# Altium project TE0888.PrjPCB
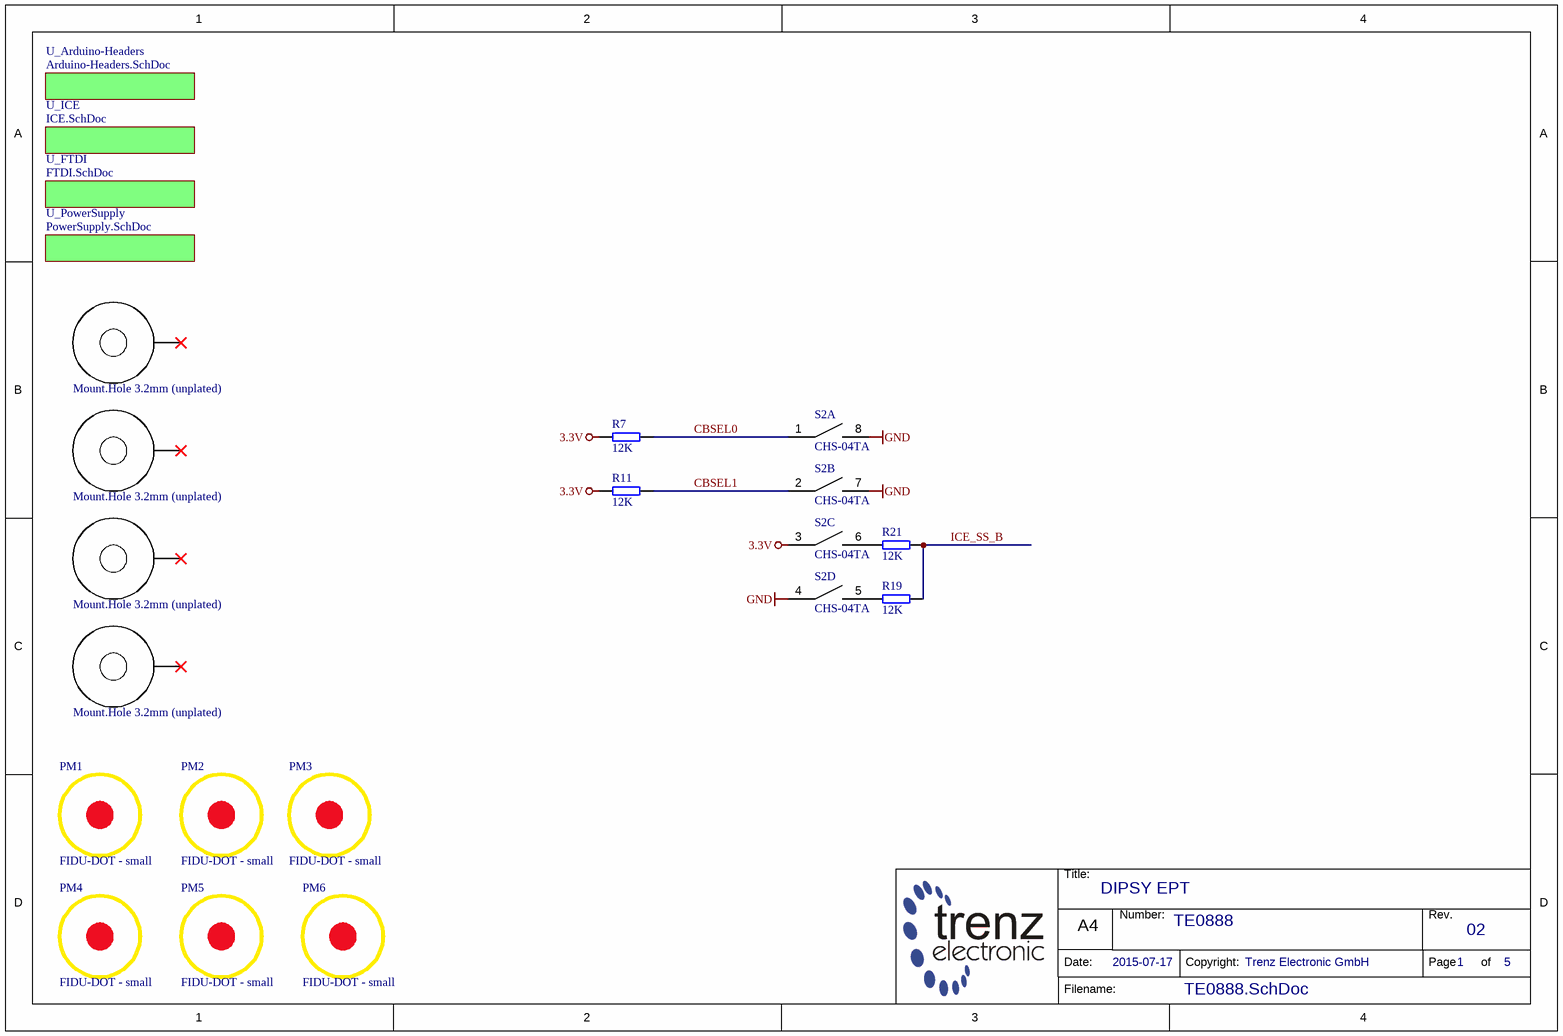
[diagram p0: TE0888.SchDoc]
5 sheets, 105 parts. Net scope: global (net labels, ports and power ports of the same name join across sheets).
Board file: TE0888.PcbDoc
Sheets:
  TE0888.SchDoc
    U_Arduino-Headers = Arduino-Headers.SchDoc
    U_FTDI = FTDI.SchDoc
    U_PowerSupply = PowerSupply.SchDoc
    U_ICE = ICE.SchDoc

## Sheet TE0888.SchDoc: DIPSY EPT
size A4; Organization: Trenz Electronic GmbH; DocumentNumber: TE0888; Revision: 02; SheetNumber: 1; SheetTotal: 5; Date: 2015-07-17; CompanyName: Trenz Electronic GmbH; ProjectName: TE0888

### Parts
H1  Mount.Hole 3.2mm (unplated)  [MHole3_2mm-UNPLATED]  (no BOM)
H2  Mount.Hole 3.2mm (unplated)  [MHole3_2mm-UNPLATED]  (no BOM)
H3  Mount.Hole 3.2mm (unplated)  [MHole3_2mm-UNPLATED]  (no BOM)
H4  Mount.Hole 3.2mm (unplated)  [MHole3_2mm-UNPLATED]  (no BOM)
PM1  FIDU-DOT - small  [FIDU-DOT - small]
PM2  FIDU-DOT - small  [FIDU-DOT - small]
PM3  FIDU-DOT - small  [FIDU-DOT - small]
PM4  FIDU-DOT - small  [FIDU-DOT - small]
PM5  FIDU-DOT - small  [FIDU-DOT - small]
PM6  FIDU-DOT - small  [FIDU-DOT - small]
R7  12K  [RESC1005X40N]
R11  12K  [RESC1005X40N]
R19  12K  [RESC1005X40N]
R21  12K  [RESC1005X40N]
S2  CHS-04TA  [CHS-04TA]  (parts A,B,C,D of 4)

### Sub-sheets
U_Arduino-Headers = Arduino-Headers.SchDoc: no entries
U_FTDI = FTDI.SchDoc: no entries
U_ICE = ICE.SchDoc: no entries
U_PowerSupply = PowerSupply.SchDoc: no entries

### Nets
3.3V: R7.2 R11.2 S2.3
GND: S2.4 S2.7 S2.8
CBSEL0: R7.1 S2.1
CBSEL1: R11.1 S2.2
ICE_SS_B: R19.1 R21.1
NetR19_2: R19.2 S2.5
NetR21_2: R21.2 S2.6

Not connected (* = marked no-connect by the designer): H1 1*; H2 1*; H3 1*; H4 1*

### Notes on the sheet
- Title:
- Number:
- Rev.
- Date:
- A4
- Copyright:
- Page
- of
- Filename:

### Library data of the parts
H1-H4 = 24910: AN: 24910; Mixed: THT
PM1-PM6 = 22905: AN: 22905; Mixed: FIDU
R7 R11 R19 R21 = 22598: WID SMD 12K 1% 0,063W; AN: 22598; Mixed: SMT; Preferred: Yes; Case: 1005 (0402); Value: 12K
S2 = 23417: DIP Schalter 4 fach 1,27mm SMD; AN: 23417; Mixed: SMT; Trenz-Stock: Yes; HelpURL: B:\AD\adlib\datasheet\CHS; Preferred: Yes

## Sheet Arduino-Headers.SchDoc: DIPSY EPT
size A4; Organization: Trenz Electronic GmbH; DocumentNumber: TE0888; Revision: 02; SheetNumber: 2; SheetTotal: 5; Date: 2015-07-17; CompanyName: Trenz Electronic GmbH; ProjectName: TE0888
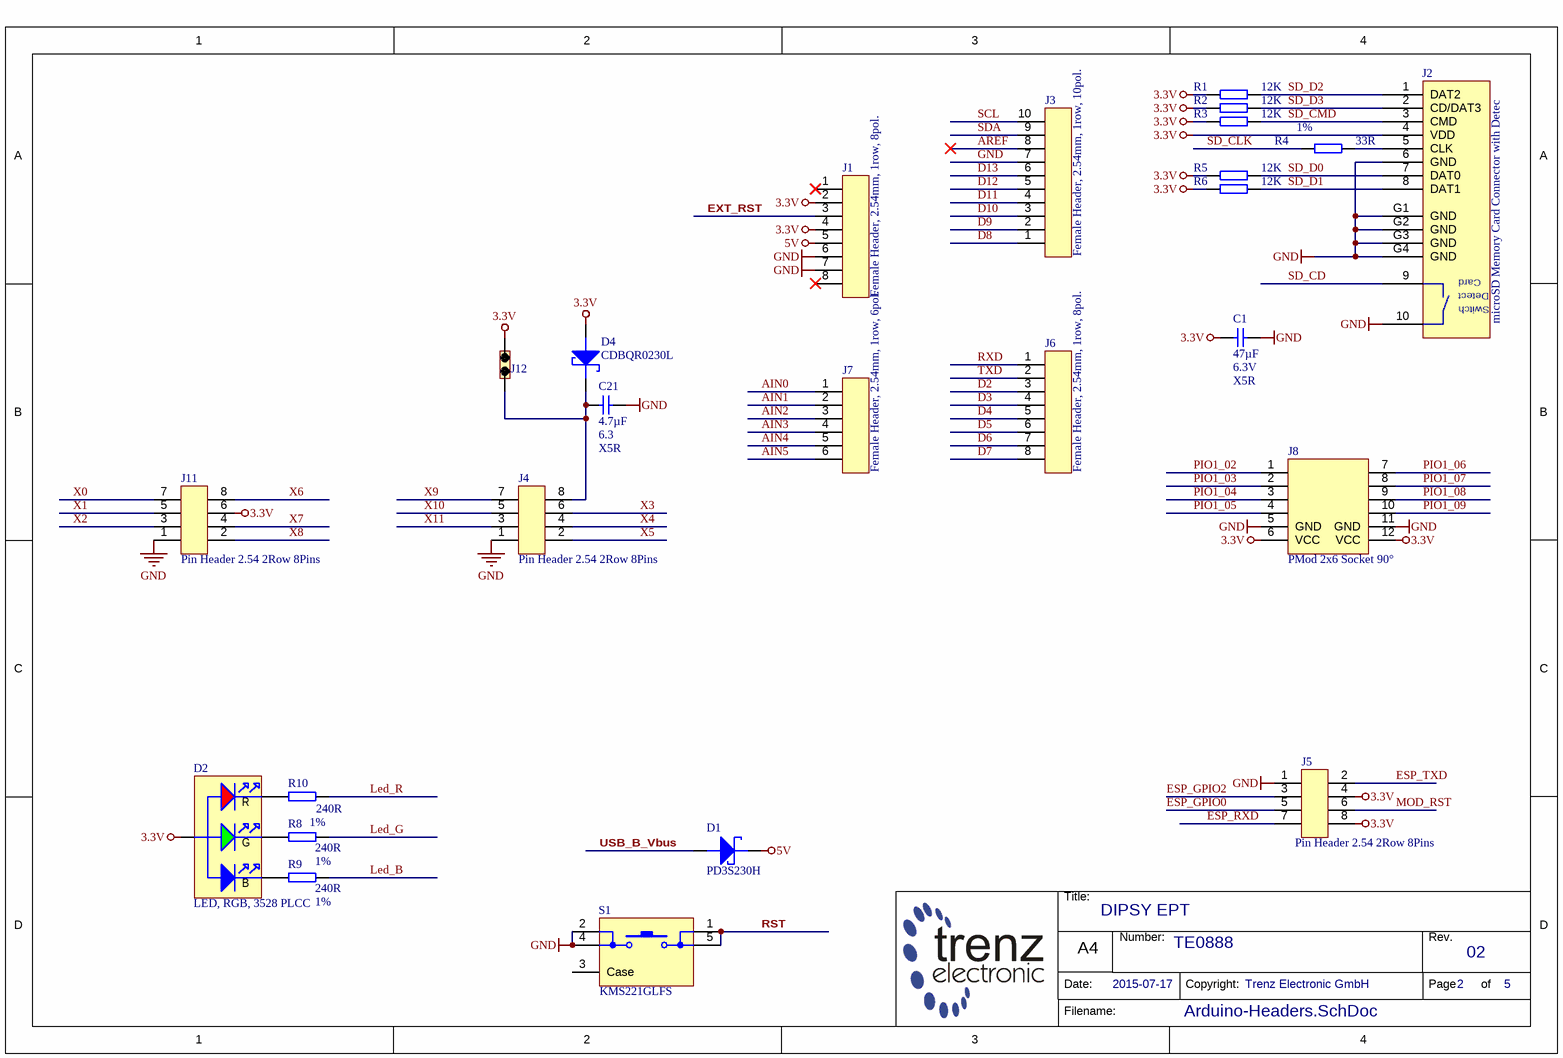
[diagram p1: Arduino-Headers.SchDoc]

### Parts
C1  47µF  Voltage: 6.3V  Technology: X5R  [CAPC2012X135N]
C21  4.7µF  Voltage: 6.3  Technology: X5R  [CAPC1005X60N]
D1  PD3S230H  [PowerDI323]
D2  LED, RGB, 3528 PLCC  [PLCC150P360X280X190-4N-WE]
D4  CDBQR0230L  [DIOC1006X55N]
J1  Female Header, 2.54mm, 1row, 8pol.  [BUCHSENLEISTE-2.54-8-1R]
J2  microSD Memory Card Connector with Detec  [104031-0811]
J3  Female Header, 2.54mm, 1row, 10pol.  [BUCHSENLEISTE-2.54-10-1R]
J4  Pin Header 2.54 2Row 8Pins  [STIFTLEISTE2_54 OG 2R-8]
J5  Pin Header 2.54 2Row 8Pins  [STIFTLEISTE2_54 OG 2R-8]
J6  Female Header, 2.54mm, 1row, 8pol.  [BUCHSENLEISTE-2.54-8-1R]
J7  Female Header, 2.54mm, 1row, 6pol.  [BUCHSENLEISTE-2.54-6-1R]
J8  PMod 2x6 Socket 90°  [PMod2x6]
J11  Pin Header 2.54 2Row 8Pins  [STIFTLEISTE2_54 OG 2R-8]
J12  JUMPER2.54-2  [JUMPER2_54-2]  (value not drawn)
R1  12K  [RESC1005X40N]
R2  12K  [RESC1005X40N]
R3  12K  [RESC1005X40N]
R4  33R  Tolerance: 1%  [RESC0603X26N]
R5  12K  [RESC1005X40N]
R6  12K  [RESC1005X40N]
R8  240R  Tolerance: 1%  [RESC1005X40N]
R9  240R  Tolerance: 1%  [RESC1005X40N]
R10  240R  Tolerance: 1%  [RESC1005X40N]
S1  KMS221GLFS  [KMS2xxGLFS]

### Nets
3.3V: C1.1 D2.1(ANODE) D4.2(ANODE) J1.2 J1.4 J2.4(VDD) J5.4 J5.8 J8.6(VCC) J8.12(VCC) J11.6 J12.1 R1.1 R2.1 R3.1 R5.1 R6.1
5V: D1.1(KATHODE) J1.5
GND: C1.2 C21.1 J1.6 J1.7 J2.6(GND) J2.10(CDSW) J2.G1(GND) J2.G2(GND) J2.G3(GND) J2.G4(GND) J3.7 J4.1 J5.1 J8.5(GND) J8.11(GND) J11.1 S1.2 S1.4
AIN0: J7.1
AIN1: J7.2
AIN2: J7.3
AIN3: J7.4
AIN4: J7.5
AIN5: J7.6
AREF: J3.8
D2: J6.3
D3: J6.4
D4: J6.5
D5: J6.6
D6: J6.7
D7: J6.8
D8: J3.1
D9: J3.2
D10: J3.3
D11: J3.4
D12: J3.5
D13: J3.6
ESP_GPIO0: J5.5
ESP_GPIO2: J5.3
ESP_RXD: J5.7
ESP_TXD: J5.2
EXT_RST: J1.3
Led_B: R9.1
Led_G: R8.1
Led_R: R10.1
MOD_RST: J5.6
PIO1_02: J8.1
PIO1_03: J8.2
PIO1_04: J8.3
PIO1_05: J8.4
PIO1_06: J8.7
PIO1_07: J8.8
PIO1_08: J8.9
PIO1_09: J8.10
RST: S1.1 S1.5
RXD: J6.1
SCL: J3.10
SD_CD: J2.9(CDSW)
SD_CLK: R4.1
SD_CMD: J2.3(CMD) R3.2
SD_D0: J2.7(DAT0) R5.2
SD_D1: J2.8(DAT1) R6.2
SD_D2: J2.1(DAT2) R1.2
SD_D3: J2.2(CD/DAT3) R2.2
SDA: J3.9
TXD: J6.2
USB_B_Vbus: D1.2(ANODE)
X0: J11.7
X1: J11.5
X2: J11.3
X3: J4.6
X4: J4.4
X5: J4.2
X6: J11.8
X7: J11.4
X8: J11.2
X9: J4.7
X10: J4.5
X11: J4.3
NetC21_2: C21.2 D4.1(KATHODE) J4.8 J12.2
NetD2_2: D2.2(BLUE) R9.2
NetD2_3: D2.3(RED) R10.2
NetD2_4: D2.4(GREEN) R8.2
NetJ2_5: J2.5(CLK) R4.2

Not connected (* = marked no-connect by the designer): J1 1* 8*; S1 3(Case)

### Notes on the sheet
- Title:
- Number:
- Rev.
- Date:
- A4
- Copyright:
- Page
- of
- Filename:
- (in symbol 26322) Card; Detect; Switch
- (in symbol 26741) R; G; B

### Library data of the parts
C1 = 24718: KON 47µF 6,3V  X5R SMD 20%; AN: 24718; Mixed: SMT; Value: 47u; Preferred: Yes; Case: 2012 (0805); Tolerance: 20%
C21 = 24719: KON 4.7µF 6.3V X5R SMD 20%; AN: 24719; Mixed: SMT; Value: 4.7u; Preferred: Yes; Case: 1005 (0402); Tolerance: 20%
D1 = 24682: AN: 24682; Mixed: SMT; Case: PowerDI323; HelpURL: B:\AD\adlib\datasheet\PD3S230H
D2 = 26741: AN: 26741; Mixed: SMT; Case: 1411 (3528) PLCC; HelpURL: B:\ad\adlib\datasheet\150141M173100
D4 = 26726: AN: 26726; Mixed: SMT; Voltage: 0.2A; Value: 30V; Case: SOD-923F (0402); HelpURL: B:\ad\adlib\datasheet\CDBQR0230L
J1 J6 = 26387: Buchsenleiste 1 reihig präz. 8 pol.; AN: 26387; Mixed: THT
J2 = 26322: microSD Memory Card Connector with Detect Switch; AN: 26322; Mixed: SMT; Trenz-Stock: Yes; Case: microSD; HelpURL: B:\AD\adlib\datasheet\104031-0811
J3 = 26386: Buchsenleiste 1 reihig präz. 10 pol.; AN: 26386; Mixed: THT
J4 J5 J11 = 23904: Stiftleiste gerade 2-reihig, 8pol.; AN: 23904; Mixed: THT; Trenz-Stock: Yes
J7 = 26388: Buchsenleiste 1 reihig präz. 6 pol.; AN: 26388; Mixed: THT
J8 = 25215: AN: 25215; Trenz-Stock: Yes; Trenz-Article-Number: 23185; Mixed: THT
J12 = 22330: Stiftleiste gerade 1-reihig, 2pol.; AN: 22330; Mixed: THT; Trenz-Stock: Yes
R1-R3 R5 R6 = 22598: as R7 on sheet TE0888; Case: 1005 (0402); Value: 12K
R4 = 25021: WID SMD 33R 1% 0,05W; AN: 25021; Mixed: SMT; Value: 33; Preferred: Yes; Case: 0603 (0201); HelpURL: B:\AD\adlib\datasheet\R0201
R8-R10 = 23661: WID SMD 240R 1% 0,063W; AN: 23661; Mixed: SMT; Value: 240; Preferred: Yes; Case: 1005 (0402)
S1 = 26229: KMS221GLFS - SWITCH, SPST, 0.05A, 32VDC, SMD; AN: 26229; Mixed: SMT; HelpURL: B:\AD\adlib\datasheet\KMS

## Sheet FTDI.SchDoc: DIPSY EPT
size A4; Organization: Trenz Electronic GmbH; DocumentNumber: TE0888; Revision: 02; SheetNumber: 4; SheetTotal: 5; Date: 2015-07-17; CompanyName: Trenz Electronic GmbH; ProjectName: TE0888
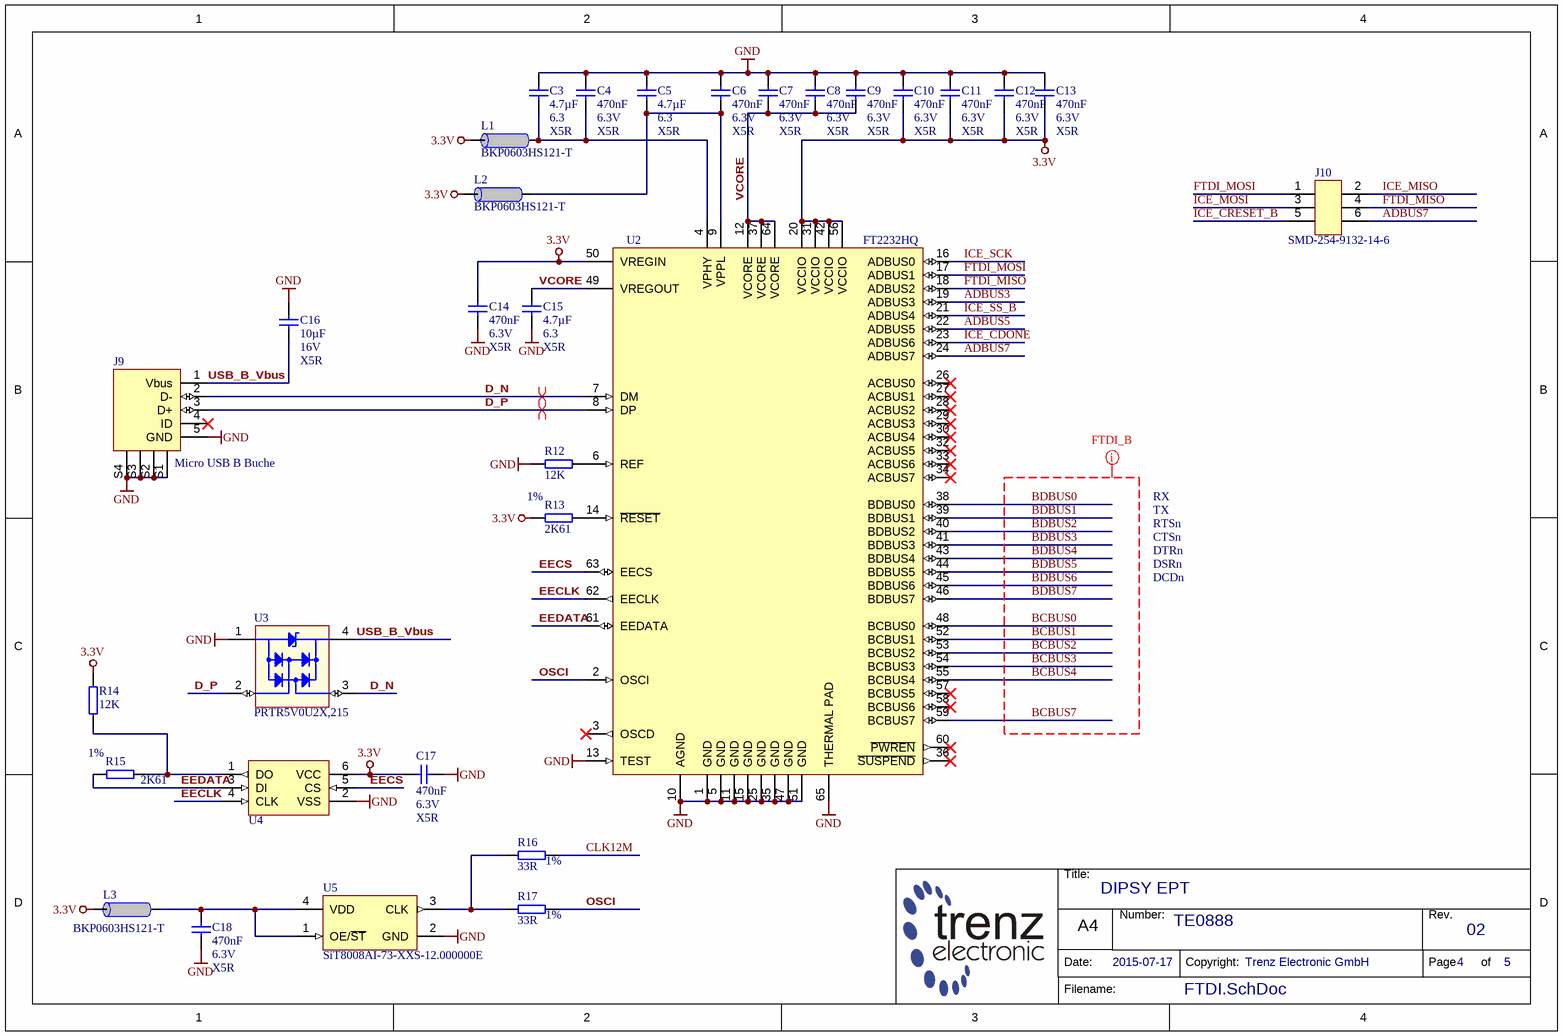
[diagram p2: FTDI.SchDoc]

### Parts
C3  4.7µF  Voltage: 6.3  Technology: X5R  [CAPC1005X60N]
C4  470nF  Voltage: 6.3V  Technology: X5R  [CAPC0603X33N]
C5  4.7µF  Voltage: 6.3  Technology: X5R  [CAPC1005X60N]
C6  470nF  Voltage: 6.3V  Technology: X5R  [CAPC0603X33N]
C7  470nF  Voltage: 6.3V  Technology: X5R  [CAPC0603X33N]
C8  470nF  Voltage: 6.3V  Technology: X5R  [CAPC0603X33N]
C9  470nF  Voltage: 6.3V  Technology: X5R  [CAPC0603X33N]
C10  470nF  Voltage: 6.3V  Technology: X5R  [CAPC0603X33N]
C11  470nF  Voltage: 6.3V  Technology: X5R  [CAPC0603X33N]
C12  470nF  Voltage: 6.3V  Technology: X5R  [CAPC0603X33N]
C13  470nF  Voltage: 6.3V  Technology: X5R  [CAPC0603X33N]
C14  470nF  Voltage: 6.3V  Technology: X5R  [CAPC0603X33N]
C15  4.7µF  Voltage: 6.3  Technology: X5R  [CAPC1005X60N]
C16  10µF  Voltage: 16V  Technology: X5R  [CAPC1608X90N]
C17  470nF  Voltage: 6.3V  Technology: X5R  [CAPC0603X33N]
C18  470nF  Voltage: 6.3V  Technology: X5R  [CAPC0603X33N]
J9  Micro USB B Buche  [Micro USB B SMD W+P]
J10  SMD-254-9132-14-6  [SMD-254-9132-14-6]
L1  BKP0603HS121-T  [INDC0603X33N]
L2  BKP0603HS121-T  [INDC0603X33N]
L3  BKP0603HS121-T  [INDC0603X33N]
R12  12K  [RESC1005X40N]
R13  2K61  Tolerance: 1%  [RESC1005X40N]
R14  12K  [RESC1005X40N]
R15  2K61  Tolerance: 1%  [RESC1005X40N]
R16  33R  Tolerance: 1%  [RESC0603X26N]
R17  33R  Tolerance: 1%  [RESC0603X26N]
U2  FT2232HQ  [QFN50P900X900X100-65N-445]
U3  PRTR5V0U2X,215  [SOT190P229X114-4N]
U4  93AA56BT-I/OT  [SOT95P280X145-6N]  (value not drawn)
U5  SiT8008AI-73-XXS-12.000000E  [2016]

### Nets
3.3V: C10.1 C11.1 C12.1 C13.1 C14.2 C17.1 L1.2 L2.2 L3.2 R13.1 R14.2 U2.20(VCCIO) U2.31(VCCIO) U2.42(VCCIO) U2.50(VREGIN) U2.56(VCCIO) U4.6(VCC)
GND: C3.2 C4.2 C5.2 C6.2 C7.2 C8.2 C9.2 C10.2 C11.2 C12.2 C13.2 C14.1 C15.1 C16.1 C17.2 C18.1 J9.5(GND) J9.S1 J9.S2 J9.S3 J9.S4 R12.1 U2.1(GND) U2.5(GND) U2.10(AGND) U2.11(GND) U2.13(TEST) U2.15(GND) U2.25(GND) U2.35(GND) U2.47(GND) U2.51(GND) U2.65(THERMAL_PAD) U3.1(GND) U4.2(VSS) U5.2(GND)
ADBUS3: U2.19(ADBUS3)
ADBUS5: U2.22(ADBUS5)
ADBUS7: J10.6 U2.24(ADBUS7)
BCBUS0: U2.48(BCBUS0)
BCBUS1: U2.52(BCBUS1)
BCBUS2: U2.53(BCBUS2)
BCBUS3: U2.54(BCBUS3)
BCBUS4: U2.55(BCBUS4)
BCBUS7: U2.59(BCBUS7)
BDBUS0: U2.38(BDBUS0)
BDBUS1: U2.39(BDBUS1)
BDBUS2: U2.40(BDBUS2)
BDBUS3: U2.41(BDBUS3)
BDBUS4: U2.43(BDBUS4)
BDBUS5: U2.44(BDBUS5)
BDBUS6: U2.45(BDBUS6)
BDBUS7: U2.46(BDBUS7)
CLK12M: R16.2
D_N: J9.2(D-) U2.7(DM) U3.3(I/O)
D_P: J9.3(D+) U2.8(DP) U3.2(I/O)
EECLK: U2.62(EECLK) U4.4(CLK)
EECS: U2.63(EECS) U4.5(CS)
EEDATA: R15.1 U2.61(EEDATA) U4.3(DI)
FTDI_MISO: J10.4 U2.18(ADBUS2)
FTDI_MOSI: J10.1 U2.17(ADBUS1)
ICE_CDONE: U2.23(ADBUS6)
ICE_CRESET_B: J10.5
ICE_MISO: J10.2
ICE_MOSI: J10.3
ICE_SCK: U2.16(ADBUS0)
ICE_SS_B: U2.21(ADBUS4)
OSCI: R17.2 U2.2(OSCI)
USB_B_Vbus: C16.2 J9.1(Vbus) U3.4(REF)
VCORE: C7.1 C8.1 C9.1 C15.2 U2.12(VCORE) U2.37(VCORE) U2.49(VREGOUT) U2.64(VCORE)
NetC3_1: C3.1 C4.1 L1.1 U2.4(VPHY)
NetC5_1: C5.1 C6.1 L2.1 U2.9(VPPL)
NetC18_2: C18.2 L3.1 U5.1(OE/~{ST}) U5.4(VDD)
NetR12_2: R12.2 U2.6(REF)
NetR13_2: R13.2 U2.14(~{RESET})
NetR14_1: R14.1 R15.2 U4.1(DO)
NetR16_1: R16.1 R17.1 U5.3(CLK)

Not connected (* = marked no-connect by the designer): J9 4(ID)*; U2 3(OSCD)* 26(ACBUS0)* 27(ACBUS1)* 28(ACBUS2)* 29(ACBUS3)* 30(ACBUS4)* 32(ACBUS5)* 33(ACBUS6)* 34(ACBUS7)* 36(~{SUSPEND})* 57(BCBUS5)* 58(BCBUS6)* 60(~{PWREN})*

### Layout directives
differential pair: D_N, D_P
net class FTDI_B: BCBUS0, BCBUS1, BCBUS2, BCBUS3, BCBUS4, BCBUS7, BDBUS0, BDBUS1, BDBUS2, BDBUS3, BDBUS4, BDBUS5, BDBUS6, BDBUS7

### Notes on the sheet
- RX
- TX
- RTSn
- CTSn
- DTRn
- DSRn
- DCDn
- Title:
- Number:
- Rev.
- Date:
- A4
- Copyright:
- Page
- of
- Filename:

### Library data of the parts
C3 C5 C15 = 24719: as C21 on sheet Arduino-Headers; Case: 1005 (0402); Tolerance: 20%
C4 C6-C14 C17 C18 = 24921: KON 470nF X5R 6.3V SMD 20%; AN: 24921; Value: 470n; Mixed: SMT; Preferred: Yes; Case: 0603 (0201); Tolerance: 20%
C16 = 25341: KON 10µF 16V X5R SMD 20%; AN: 25341; Mixed: SMT; Value: 10u; Preferred: Yes; Case: 1608 (0603); Tolerance: 20%
J9 = 23760: STE USB MICRO B Buchse SMD; AN: 23760; Mixed: SMT; Trenz-Stock: Yes; HelpURL: B:\AD\adlib\datasheet\8270
J10 = 22742: Stiftleiste gerade 2-reihig, 6pol. SMD; AN: 22742; Mixed: SMT; Trenz-Stock: Yes
L1-L3 = 25393: Ferritdurchführung SMD 0201; AN: 25393; Mixed: SMT; Trenz-Stock: Yes; Tolerance: 25%; Case: 0603 (0201); HelpURL: B:\AD\adlib\datasheet\MULTILAYER CHIP BEAD INDUCTORS BK; Preferred: Yes
R12 R14 = 22598: as R7 on sheet TE0888; Case: 1005 (0402); Value: 12K
R13 R15 = 23730: WID SMD 2K61 1% 0,063W; AN: 23730; Mixed: SMT; Value: 2.61K; Preferred: Yes; Case: 1005 (0402)
R16 R17 = 25021: as R4 on sheet Arduino-Headers; Case: 0603 (0201); HelpURL: B:\AD\adlib\datasheet\R0201
U2 = 24727: AN: 24727; Trenz-Stock: Yes; Mixed: SMT; Case: QFN64; HelpURL: B:\AD\adlib\datasheet\FT2232H; Preferred: Yes
U3 = 24840: AN: 24840; Mixed: SMT; Preferred: Yes; Case: SOT143; HelpURL: B:\AD\adlib\datasheet\CD143A-SR05
U4 = 24730: AN: 24730; Trenz-Stock: Yes; Mixed: SMT; Case: SOT23-6; HelpURL: B:\AD\adlib\datasheet\93AA56A; Preferred: Yes
U5 = 25325: SiT8008AI-73-XXS-12.000000E MEMS Oszillator 12MHz; AN: 25325; Value: 12M; Trenz-Stock: Yes; Mixed: SMT; Case: 2.0  x 1.6mm; HelpURL: B:\AD\adlib\datasheet\SiT8008; Preferred: Yes

## Sheet PowerSupply.SchDoc: DIPSY EPT
size A4; PageSetup: Record=PageOptions|CenterHorizontal=True|CenterVertical=True|PrintScale=0.96|XCorrection=1.00|YCorrection=1.00|PrintKind=0|BorderSize=5000000|LeftOffset=0|BottomOffset=0|Orientation=2|PaperLength=1000|PaperWidth=1000|Scale=100|PaperSource=7|PrintQuality=-4|MediaType=1|DitherType=10|PaperKind=A4|PrintScaleMode=1; Organization: Trenz Electronic GmbH; DocumentNumber: TE0888; Revision: 02; SheetNumber: 5; SheetTotal: 5; Date: 2015-07-17; CompanyName: Trenz Electronic GmbH; ProjectName: TE0888
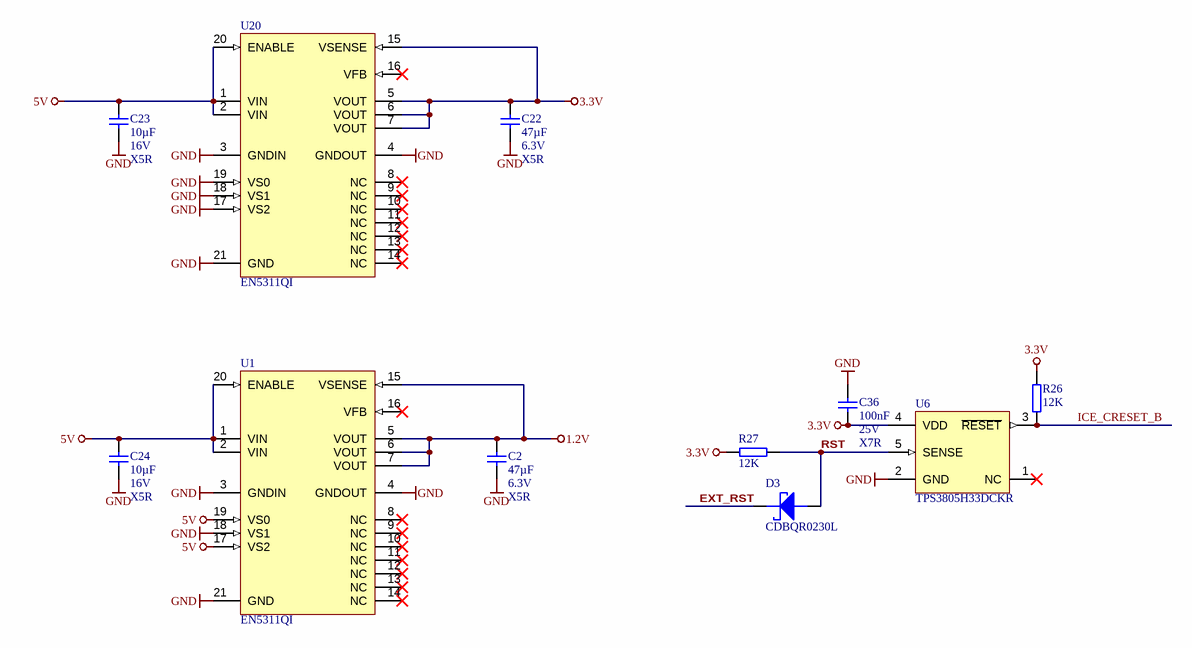
[diagram p3: PowerSupply.SchDoc]

### Parts
C2  47µF  Voltage: 6.3V  Technology: X5R  [CAPC2012X135N]
C22  47µF  Voltage: 6.3V  Technology: X5R  [CAPC2012X135N]
C23  10µF  Voltage: 16V  Technology: X5R  [CAPC1608X90N]
C24  10µF  Voltage: 16V  Technology: X5R  [CAPC1608X90N]
C36  100nF  Voltage: 25V  Technology: X7R  [CAPC1005X55N]
D3  CDBQR0230L  [DIOC1006X55N]
R26  12K  [RESC1005X40N]
R27  12K  [RESC1005X40N]
U1  EN5311QI  [EN5311QI]
U6  TPS3805H33DCKR  [SOT65P210X110-5N]
U20  EN5311QI  [EN5311QI]

### Nets
1.2V: C2.2 U1.5(VOUT) U1.6(VOUT) U1.7(VOUT) U1.15(VSENSE)
3.3V: C22.2 C36.2 R26.2 R27.2 U6.4(VDD) U20.5(VOUT) U20.6(VOUT) U20.7(VOUT) U20.15(VSENSE)
5V: C23.1 C24.1 U1.1(VIN) U1.2(VIN) U1.17(VS2) U1.19(VS0) U1.20(ENABLE) U20.1(VIN) U20.2(VIN) U20.20(ENABLE)
GND: C2.1 C22.1 C23.2 C24.2 C36.1 U1.3(GNDIN) U1.4(GNDOUT) U1.18(VS1) U1.21(GND) U6.2(GND) U20.3(GNDIN) U20.4(GNDOUT) U20.17(VS2) U20.18(VS1) U20.19(VS0) U20.21(GND)
EXT_RST: D3.1(KATHODE)
ICE_CRESET_B: R26.1 U6.3(~{RESET})
RST: D3.2(ANODE) R27.1 U6.5(SENSE)

Not connected (* = marked no-connect by the designer): U1 8(NC)* 9(NC)* 10(NC)* 11(NC)* 12(NC)* 13(NC)* 14(NC)* 16(VFB)*; U6 1(NC)*; U20 8(NC)* 9(NC)* 10(NC)* 11(NC)* 12(NC)* 13(NC)* 14(NC)* 16(VFB)*

### Notes on the sheet
- Title:
- Number:
- Rev.
- Date:
- A4
- Copyright:
- Page
- of
- Filename:

### Library data of the parts
C2 C22 = 24718: as C1 on sheet Arduino-Headers; Case: 2012 (0805); Tolerance: 20%
C23 C24 = 25341: as C16 on sheet FTDI; Case: 1608 (0603); Tolerance: 20%
C36 = 22472: KON 100nF 25V X5R SMD; AN: 22472; Mixed: SMT; Value: 100n; Preferred: Yes; Case: 1005 (0402)
D3 = 26726: as D4 on sheet Arduino-Headers; Case: SOD-923F (0402); HelpURL: B:\ad\adlib\datasheet\CDBQR0230L
R26 R27 = 22598: as R7 on sheet TE0888; Case: 1005 (0402); Value: 12K
U1 U20 = 25492: AN: 25492; Mixed: SMT; Trenz-Stock: Yes; Case: QFN20; HelpURL: B:\AD\adlib\datasheet\EN5311QI; Preferred: Yes
U6 = 25049: AN: 25049; Mixed: SMT; Trenz-Stock: Yes; Case: SC70-5 / SC88A / SOT353; HelpURL: B:\AD\adlib\datasheet\TPS3805H33; Preferred: Yes

## Sheet ICE.SchDoc: DIPSY EPT
size A4; PageSetup: Record=PageOptions|CenterHorizontal=True|CenterVertical=True|PrintScale=0.96|XCorrection=1.00|YCorrection=1.00|PrintKind=0|BorderSize=5000000|LeftOffset=0|BottomOffset=0|Orientation=2|PaperLength=1000|PaperWidth=1000|Scale=100|PaperSource=7|PrintQuality=-4|MediaType=1|DitherType=10|PaperKind=A4|PrintScaleMode=1; Organization: Trenz Electronic GmbH; DocumentNumber: TE0888; Revision: 02; SheetNumber: 3; SheetTotal: 5; Date: 2015-07-17; CompanyName: Trenz Electronic GmbH; ProjectName: TE0888
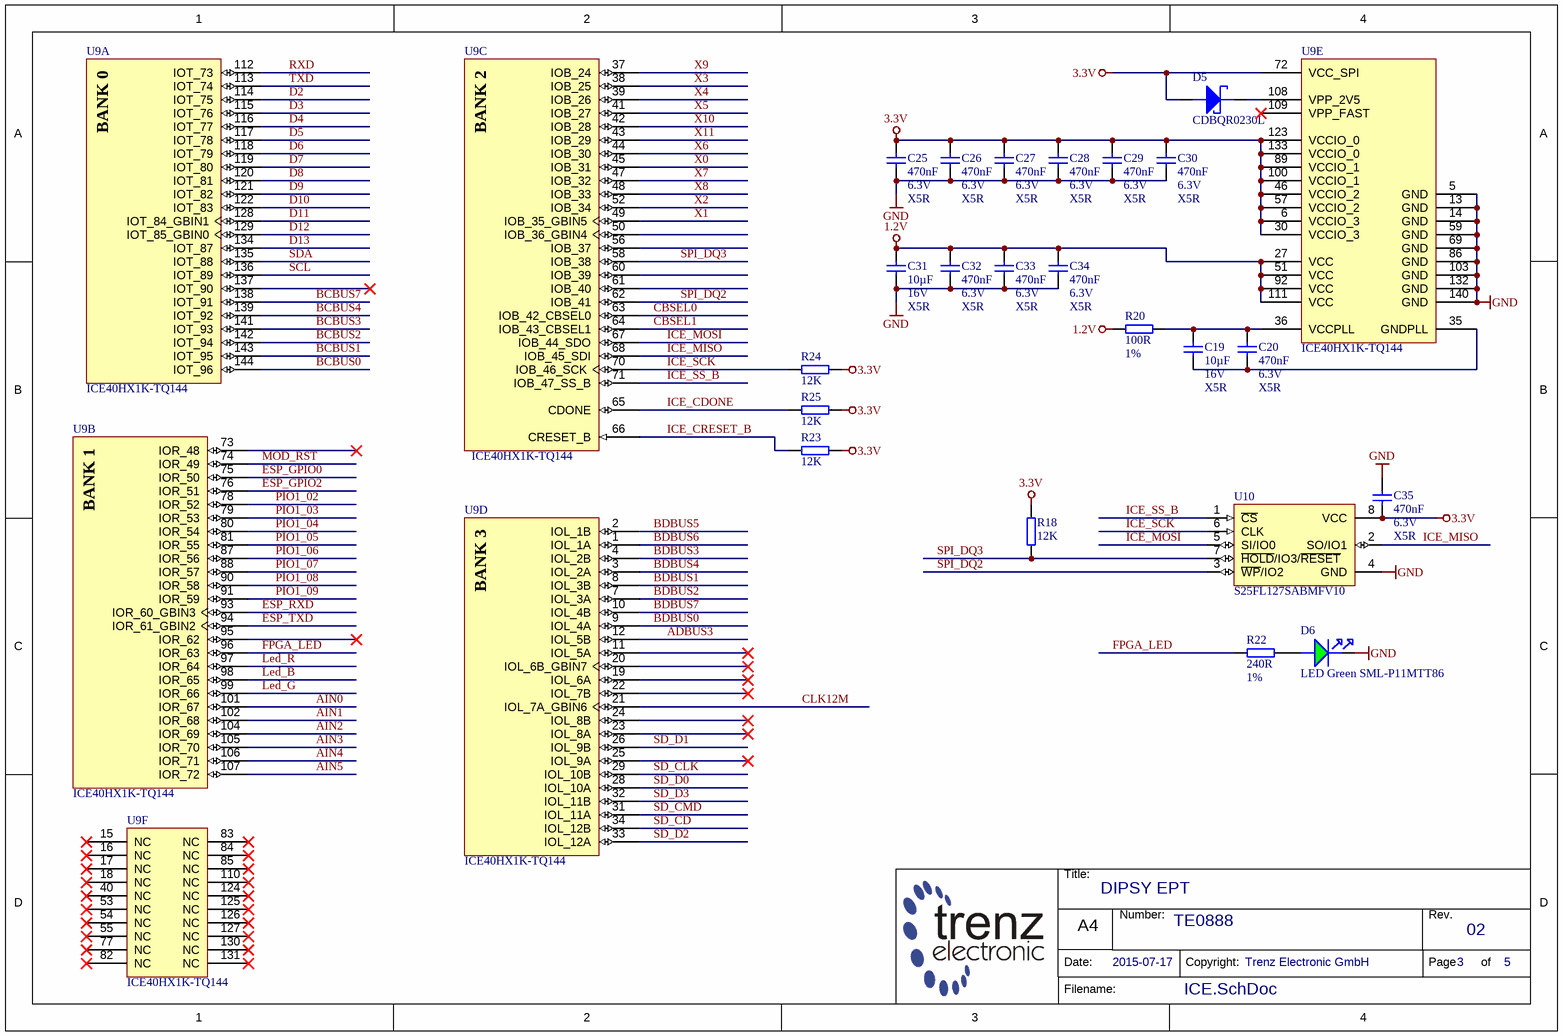
[diagram p4: ICE.SchDoc]

### Parts
C19  10µF  Voltage: 16V  Technology: X5R  [CAPC1608X90N]
C20  470nF  Voltage: 6.3V  Technology: X5R  [CAPC0603X33N]
C25  470nF  Voltage: 6.3V  Technology: X5R  [CAPC0603X33N]
C26  470nF  Voltage: 6.3V  Technology: X5R  [CAPC0603X33N]
C27  470nF  Voltage: 6.3V  Technology: X5R  [CAPC0603X33N]
C28  470nF  Voltage: 6.3V  Technology: X5R  [CAPC0603X33N]
C29  470nF  Voltage: 6.3V  Technology: X5R  [CAPC0603X33N]
C30  470nF  Voltage: 6.3V  Technology: X5R  [CAPC0603X33N]
C31  10µF  Voltage: 16V  Technology: X5R  [CAPC1608X90N]
C32  470nF  Voltage: 6.3V  Technology: X5R  [CAPC0603X33N]
C33  470nF  Voltage: 6.3V  Technology: X5R  [CAPC0603X33N]
C34  470nF  Voltage: 6.3V  Technology: X5R  [CAPC0603X33N]
C35  470nF  Voltage: 6.3V  Technology: X5R  [CAPC0603X33N]
D5  CDBQR0230L  [DIOC1006X55N]
D6  LED Green SML-P11MTT86  [LEDC1006X25N_GREEN]
R18  12K  [RESC1005X40N]
R20  100R  Tolerance: 1%  [RESC1005X40N]
R22  240R  Tolerance: 1%  [RESC1005X40N]
R23  12K  [RESC1005X40N]
R24  12K  [RESC1005X40N]
R25  12K  [RESC1005X40N]
U9  ICE40HX1K-TQ144  [QFP50P2200X2200X160-144N]  (parts A,B,C,D,E,F of 6)
U10  S25FL127SABMFV10  [SOIC127P790X216-8N]

### Nets
1.2V: C31.1 C32.2 C33.2 C34.2 R20.1 U9.27(VCC) U9.51(VCC) U9.92(VCC) U9.111(VCC)
3.3V: C25.2 C26.2 C27.2 C28.2 C29.2 C30.2 C35.1 D5.2(ANODE) R18.1 R23.1 R24.1 R25.1 U9.6(VCCIO_3) U9.30(VCCIO_3) U9.46(VCCIO_2) U9.57(VCCIO_2) U9.72(VCC_SPI) U9.89(VCCIO_1) U9.100(VCCIO_1) U9.123(VCCIO_0) U9.133(VCCIO_0) U10.8(VCC)
GND: C25.1 C26.1 C27.1 C28.1 C29.1 C30.1 C31.2 C32.1 C33.1 C34.1 C35.2 D6.K U9.5(GND) U9.13(GND) U9.14(GND) U9.59(GND) U9.69(GND) U9.86(GND) U9.103(GND) U9.132(GND) U9.140(GND) U10.4(GND)
ADBUS3: U9.12(IOL_5B)
AIN0: U9.101(IOR_67)
AIN1: U9.102(IOR_68)
AIN2: U9.104(IOR_69)
AIN3: U9.105(IOR_70)
AIN4: U9.106(IOR_71)
AIN5: U9.107(IOR_72)
BCBUS0: U9.144(IOT_96)
BCBUS1: U9.143(IOT_95)
BCBUS2: U9.142(IOT_94)
BCBUS3: U9.141(IOT_93)
BCBUS4: U9.139(IOT_92)
BCBUS7: U9.138(IOT_91)
BDBUS0: U9.9(IOL_4A)
BDBUS1: U9.8(IOL_3B)
BDBUS2: U9.7(IOL_3A)
BDBUS3: U9.4(IOL_2B)
BDBUS4: U9.3(IOL_2A)
BDBUS5: U9.2(IOL_1B)
BDBUS6: U9.1(IOL_1A)
BDBUS7: U9.10(IOL_4B)
CBSEL0: U9.63(IOB_42_CBSEL0)
CBSEL1: U9.64(IOB_43_CBSEL1)
CLK12M: U9.21(IOL_7A_GBIN6)
D2: U9.114(IOT_75)
D3: U9.115(IOT_76)
D4: U9.116(IOT_77)
D5: U9.117(IOT_78)
D6: U9.118(IOT_79)
D7: U9.119(IOT_80)
D8: U9.120(IOT_81)
D9: U9.121(IOT_82)
D10: U9.122(IOT_83)
D11: U9.128(IOT_84_GBIN1)
D12: U9.129(IOT_85_GBIN0)
D13: U9.134(IOT_87)
ESP_GPIO0: U9.75(IOR_50)
ESP_GPIO2: U9.76(IOR_51)
ESP_RXD: U9.93(IOR_60_GBIN3)
ESP_TXD: U9.94(IOR_61_GBIN2)
FPGA_LED: R22.2 U9.96(IOR_63)
ICE_CDONE: R25.2 U9.65(CDONE)
ICE_CRESET_B: R23.2 U9.66(CRESET_B)
ICE_MISO: U9.68(IOB_45_SDI) U10.2(SO/IO1)
ICE_MOSI: U9.67(IOB_44_SDO) U10.5(SI/IO0)
ICE_SCK: R24.2 U9.70(IOB_46_SCK) U10.6(CLK)
ICE_SS_B: U9.71(IOB_47_SS_B) U10.1(~{CS})
Led_B: U9.98(IOR_65)
Led_G: U9.99(IOR_66)
Led_R: U9.97(IOR_64)
MOD_RST: U9.74(IOR_49)
PIO1_02: U9.78(IOR_52)
PIO1_03: U9.79(IOR_53)
PIO1_04: U9.80(IOR_54)
PIO1_05: U9.81(IOR_55)
PIO1_06: U9.87(IOR_56)
PIO1_07: U9.88(IOR_57)
PIO1_08: U9.90(IOR_58)
PIO1_09: U9.91(IOR_59)
RXD: U9.112(IOT_73)
SCL: U9.136(IOT_89)
SD_CD: U9.34(IOL_12B)
SD_CLK: U9.29(IOL_10B)
SD_CMD: U9.31(IOL_11A)
SD_D0: U9.28(IOL_10A)
SD_D1: U9.26(IOL_9B)
SD_D2: U9.33(IOL_12A)
SD_D3: U9.32(IOL_11B)
SDA: U9.135(IOT_88)
SPI_DQ2: U9.62(IOB_41) U10.3(~{WP}/IO2)
SPI_DQ3: R18.2 U9.58(IOB_38) U10.7(~{HOLD}/IO3/~{RESET})
TXD: U9.113(IOT_74)
X0: U9.45(IOB_31)
X1: U9.49(IOB_35_GBIN5)
X2: U9.52(IOB_34)
X3: U9.38(IOB_25)
X4: U9.39(IOB_26)
X5: U9.41(IOB_27)
X6: U9.44(IOB_30)
X7: U9.47(IOB_32)
X8: U9.48(IOB_33)
X9: U9.37(IOB_24)
X10: U9.42(IOB_28)
X11: U9.43(IOB_29)
NetC19_1: C19.1 C20.2 R20.2 U9.36(VCCPLL)
NetC19_2: C19.2 C20.1 U9.35(GNDPLL)
NetD5_1: D5.1(KATHODE) U9.108(VPP_2V5)
NetD6_A: D6.A R22.1

Not connected (* = marked no-connect by the designer): U9 11(IOL_5A)* 15(NC)* 16(NC)* 17(NC)* 18(NC)* 19(IOL_6A)* 20(IOL_6B_GBIN7)* 22(IOL_7B)* 23(IOL_8A)* 24(IOL_8B)* 25(IOL_9A)* 40(NC)* 50(IOB_36_GBIN4) 53(NC)* 54(NC)* 55(NC)* 56(IOB_37) 60(IOB_39) 61(IOB_40) 73(IOR_48)* 77(NC)* 82(NC)* 83(NC)* 84(NC)* 85(NC)* 95(IOR_62)* 109(VPP_FAST)* 110(NC)* 124(NC)* 125(NC)* 126(NC)* 127(NC)* 130(NC)* 131(NC)* 137(IOT_90)*

### Notes on the sheet
- Title:
- Number:
- Rev.
- Date:
- A4
- Copyright:
- Page
- of
- Filename:
- (in symbol 26738, part A) BANK 0
- (in symbol 26738, part B) BANK 1
- (in symbol 26738, part C) BANK 2
- (in symbol 26738, part D) BANK 3

### Library data of the parts
C19 C31 = 25341: as C16 on sheet FTDI; Case: 1608 (0603); Tolerance: 20%
C20 C25-C30 C32-C35 = 24921: as C4 on sheet FTDI; Case: 0603 (0201); Tolerance: 20%
D5 = 26726: as D4 on sheet Arduino-Headers; Case: SOD-923F (0402); HelpURL: B:\ad\adlib\datasheet\CDBQR0230L
D6 = 24211: LED Grün SML-P11MTT86 SMD; AN: 24211; Mixed: SMT; Preferred: Yes; Case: 1005 (0402); HelpURL: B:\AD\adlib\datasheet\SML-P1
R18 R23-R25 = 22598: as R7 on sheet TE0888; Case: 1005 (0402); Value: 12K
R20 = 22507: WID SMD 100R 1% 0,063W; AN: 22507; Mixed: SMT; Value: 100; Preferred: Yes; Case: 1005 (0402)
R22 = 23661: as R8 on sheet Arduino-Headers; Case: 1005 (0402)
U9 = 26738: AN: 26738; Mixed: SMT; Case: TQ144; HelpURL: B:\AD\adlib\datasheet\ICE40
U10 = 26078: S25FL127SABMFV10 automotive SO8; AN: 26078; Mixed: SMT; Case: SO8W; HelpURL: B:\AD\adlib\datasheet\S25FL12xS

## Nets that join several sheets
1.2V: PowerSupply (5 pins), ICE (9 pins)
3.3V: TE0888 (R7.2 R11.2 S2.3), Arduino-Headers (17 pins), FTDI (17 pins), PowerSupply (9 pins), ICE (22 pins)
5V: Arduino-Headers (D1.1 J1.5), PowerSupply (10 pins)
GND: TE0888 (S2.4 S2.7 S2.8), Arduino-Headers (18 pins), FTDI (36 pins), PowerSupply (16 pins), ICE (22 pins)
ADBUS3: FTDI (U2.19), ICE (U9.12)
AIN0: Arduino-Headers (J7.1), ICE (U9.101)
AIN1: Arduino-Headers (J7.2), ICE (U9.102)
AIN2: Arduino-Headers (J7.3), ICE (U9.104)
AIN3: Arduino-Headers (J7.4), ICE (U9.105)
AIN4: Arduino-Headers (J7.5), ICE (U9.106)
AIN5: Arduino-Headers (J7.6), ICE (U9.107)
BCBUS0: FTDI (U2.48), ICE (U9.144)
BCBUS1: FTDI (U2.52), ICE (U9.143)
BCBUS2: FTDI (U2.53), ICE (U9.142)
BCBUS3: FTDI (U2.54), ICE (U9.141)
BCBUS4: FTDI (U2.55), ICE (U9.139)
BCBUS7: FTDI (U2.59), ICE (U9.138)
BDBUS0: FTDI (U2.38), ICE (U9.9)
BDBUS1: FTDI (U2.39), ICE (U9.8)
BDBUS2: FTDI (U2.40), ICE (U9.7)
BDBUS3: FTDI (U2.41), ICE (U9.4)
BDBUS4: FTDI (U2.43), ICE (U9.3)
BDBUS5: FTDI (U2.44), ICE (U9.2)
BDBUS6: FTDI (U2.45), ICE (U9.1)
BDBUS7: FTDI (U2.46), ICE (U9.10)
CBSEL0: TE0888 (R7.1 S2.1), ICE (U9.63)
CBSEL1: TE0888 (R11.1 S2.2), ICE (U9.64)
CLK12M: FTDI (R16.2), ICE (U9.21)
D2: Arduino-Headers (J6.3), ICE (U9.114)
D3: Arduino-Headers (J6.4), ICE (U9.115)
D4: Arduino-Headers (J6.5), ICE (U9.116)
D5: Arduino-Headers (J6.6), ICE (U9.117)
D6: Arduino-Headers (J6.7), ICE (U9.118)
D7: Arduino-Headers (J6.8), ICE (U9.119)
D8: Arduino-Headers (J3.1), ICE (U9.120)
D9: Arduino-Headers (J3.2), ICE (U9.121)
D10: Arduino-Headers (J3.3), ICE (U9.122)
D11: Arduino-Headers (J3.4), ICE (U9.128)
D12: Arduino-Headers (J3.5), ICE (U9.129)
D13: Arduino-Headers (J3.6), ICE (U9.134)
ESP_GPIO0: Arduino-Headers (J5.5), ICE (U9.75)
ESP_GPIO2: Arduino-Headers (J5.3), ICE (U9.76)
ESP_RXD: Arduino-Headers (J5.7), ICE (U9.93)
ESP_TXD: Arduino-Headers (J5.2), ICE (U9.94)
EXT_RST: Arduino-Headers (J1.3), PowerSupply (D3.1)
ICE_CDONE: FTDI (U2.23), ICE (R25.2 U9.65)
ICE_CRESET_B: FTDI (J10.5), PowerSupply (R26.1 U6.3), ICE (R23.2 U9.66)
ICE_MISO: FTDI (J10.2), ICE (U9.68 U10.2)
ICE_MOSI: FTDI (J10.3), ICE (U9.67 U10.5)
ICE_SCK: FTDI (U2.16), ICE (R24.2 U9.70 U10.6)
ICE_SS_B: TE0888 (R19.1 R21.1), FTDI (U2.21), ICE (U9.71 U10.1)
Led_B: Arduino-Headers (R9.1), ICE (U9.98)
Led_G: Arduino-Headers (R8.1), ICE (U9.99)
Led_R: Arduino-Headers (R10.1), ICE (U9.97)
MOD_RST: Arduino-Headers (J5.6), ICE (U9.74)
PIO1_02: Arduino-Headers (J8.1), ICE (U9.78)
PIO1_03: Arduino-Headers (J8.2), ICE (U9.79)
PIO1_04: Arduino-Headers (J8.3), ICE (U9.80)
PIO1_05: Arduino-Headers (J8.4), ICE (U9.81)
PIO1_06: Arduino-Headers (J8.7), ICE (U9.87)
PIO1_07: Arduino-Headers (J8.8), ICE (U9.88)
PIO1_08: Arduino-Headers (J8.9), ICE (U9.90)
PIO1_09: Arduino-Headers (J8.10), ICE (U9.91)
RST: Arduino-Headers (S1.1 S1.5), PowerSupply (D3.2 R27.1 U6.5)
RXD: Arduino-Headers (J6.1), ICE (U9.112)
SCL: Arduino-Headers (J3.10), ICE (U9.136)
SD_CD: Arduino-Headers (J2.9), ICE (U9.34)
SD_CLK: Arduino-Headers (R4.1), ICE (U9.29)
SD_CMD: Arduino-Headers (J2.3 R3.2), ICE (U9.31)
SD_D0: Arduino-Headers (J2.7 R5.2), ICE (U9.28)
SD_D1: Arduino-Headers (J2.8 R6.2), ICE (U9.26)
SD_D2: Arduino-Headers (J2.1 R1.2), ICE (U9.33)
SD_D3: Arduino-Headers (J2.2 R2.2), ICE (U9.32)
SDA: Arduino-Headers (J3.9), ICE (U9.135)
TXD: Arduino-Headers (J6.2), ICE (U9.113)
USB_B_Vbus: Arduino-Headers (D1.2), FTDI (C16.2 J9.1 U3.4)
X0: Arduino-Headers (J11.7), ICE (U9.45)
X1: Arduino-Headers (J11.5), ICE (U9.49)
X2: Arduino-Headers (J11.3), ICE (U9.52)
X3: Arduino-Headers (J4.6), ICE (U9.38)
X4: Arduino-Headers (J4.4), ICE (U9.39)
X5: Arduino-Headers (J4.2), ICE (U9.41)
X6: Arduino-Headers (J11.8), ICE (U9.44)
X7: Arduino-Headers (J11.4), ICE (U9.47)
X8: Arduino-Headers (J11.2), ICE (U9.48)
X9: Arduino-Headers (J4.7), ICE (U9.37)
X10: Arduino-Headers (J4.5), ICE (U9.42)
X11: Arduino-Headers (J4.3), ICE (U9.43)

## Assembly variants
Default: not fitted J1 J3 J4 J5 J6 J7 J11 J12